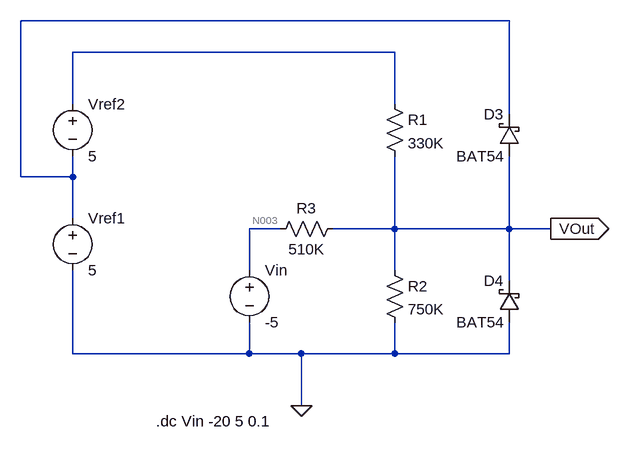
[diagram p0: schematic v-measure.asc]
v-measure.asc, the LTspice schematic file:
Version 4
SHEET 1 880 680
WIRE 16 -96 -736 -96
WIRE -160 -48 -656 -48
WIRE -656 32 -656 -48
WIRE -160 32 -160 -48
WIRE 16 48 16 -96
WIRE -736 144 -736 -96
WIRE -656 144 -656 112
WIRE -656 144 -736 144
WIRE -656 208 -656 144
WIRE -336 224 -384 224
WIRE -160 224 -160 112
WIRE -160 224 -256 224
WIRE 16 224 16 112
WIRE 16 224 -160 224
WIRE 80 224 16 224
WIRE -384 288 -384 224
WIRE -160 288 -160 224
WIRE 16 304 16 224
WIRE -656 416 -656 288
WIRE -384 416 -384 368
WIRE -384 416 -656 416
WIRE -304 416 -384 416
WIRE -160 416 -160 368
WIRE -160 416 -304 416
WIRE 16 416 16 368
WIRE 16 416 -160 416
WIRE -304 496 -304 416
FLAG -304 496 0
FLAG 80 224 VOut
IOPIN 80 224 Out
SYMBOL voltage -384 272 R0
SYMATTR InstName Vin
SYMATTR Value -5
SYMBOL res -176 16 R0
SYMATTR InstName R1
SYMATTR Value 330K
SYMBOL res -176 272 R0
SYMATTR InstName R2
SYMATTR Value 750K
SYMBOL res -240 208 R90
WINDOW 0 0 56 VBottom 2
WINDOW 3 32 56 VTop 2
SYMATTR InstName R3
SYMATTR Value 510K
SYMBOL voltage -656 192 R0
WINDOW 123 0 0 Left 2
WINDOW 39 0 0 Left 2
SYMATTR InstName Vref1
SYMATTR Value 5
SYMBOL schottky 32 112 R180
WINDOW 0 24 64 Left 2
WINDOW 3 24 0 Left 2
SYMATTR InstName D3
SYMATTR Value BAT54
SYMBOL schottky 32 368 R180
WINDOW 0 24 64 Left 2
WINDOW 3 24 0 Left 2
SYMATTR InstName D4
SYMATTR Value BAT54
SYMBOL voltage -656 16 R0
SYMATTR InstName Vref2
SYMATTR Value 5
TEXT -528 520 Left 2 !.dc Vin -20 5 0.1

The netlist it stands for:
* v-measure.asc
Vin N003 0 -5
R1 N002 VOut 330K
R2 VOut 0 750K
R3 VOut N003 510K
Vref1 N001 0 5
D3 VOut N001 BAT54
D4 0 VOut BAT54
Vref2 N002 N001 5
.model D D
.lib standard.dio
.dc Vin -20 5 0.1
.backanno
.end

* Results of the author's LTspice run, read from the files saved beside the schematic
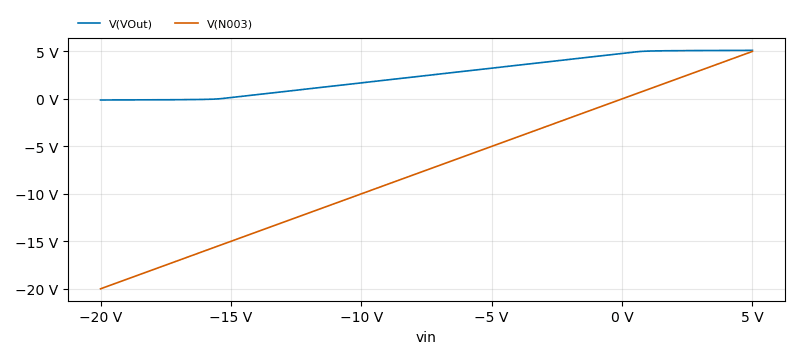
[diagram p1: DC transfer characteristic of v-measure.asc, plotted from the saved traces]
* DC transfer characteristic, 1 run:
*   V(VOut): -114 mV at vin=-20 V, 5.113 V at vin=5 V, min -114 mV, max 5.113 V
*   V(N003): -20 V at vin=-20 V, 5 V at vin=5 V, min -20 V, max 5 V